# EAGLE design nrf_can (EAGLE 6.4)
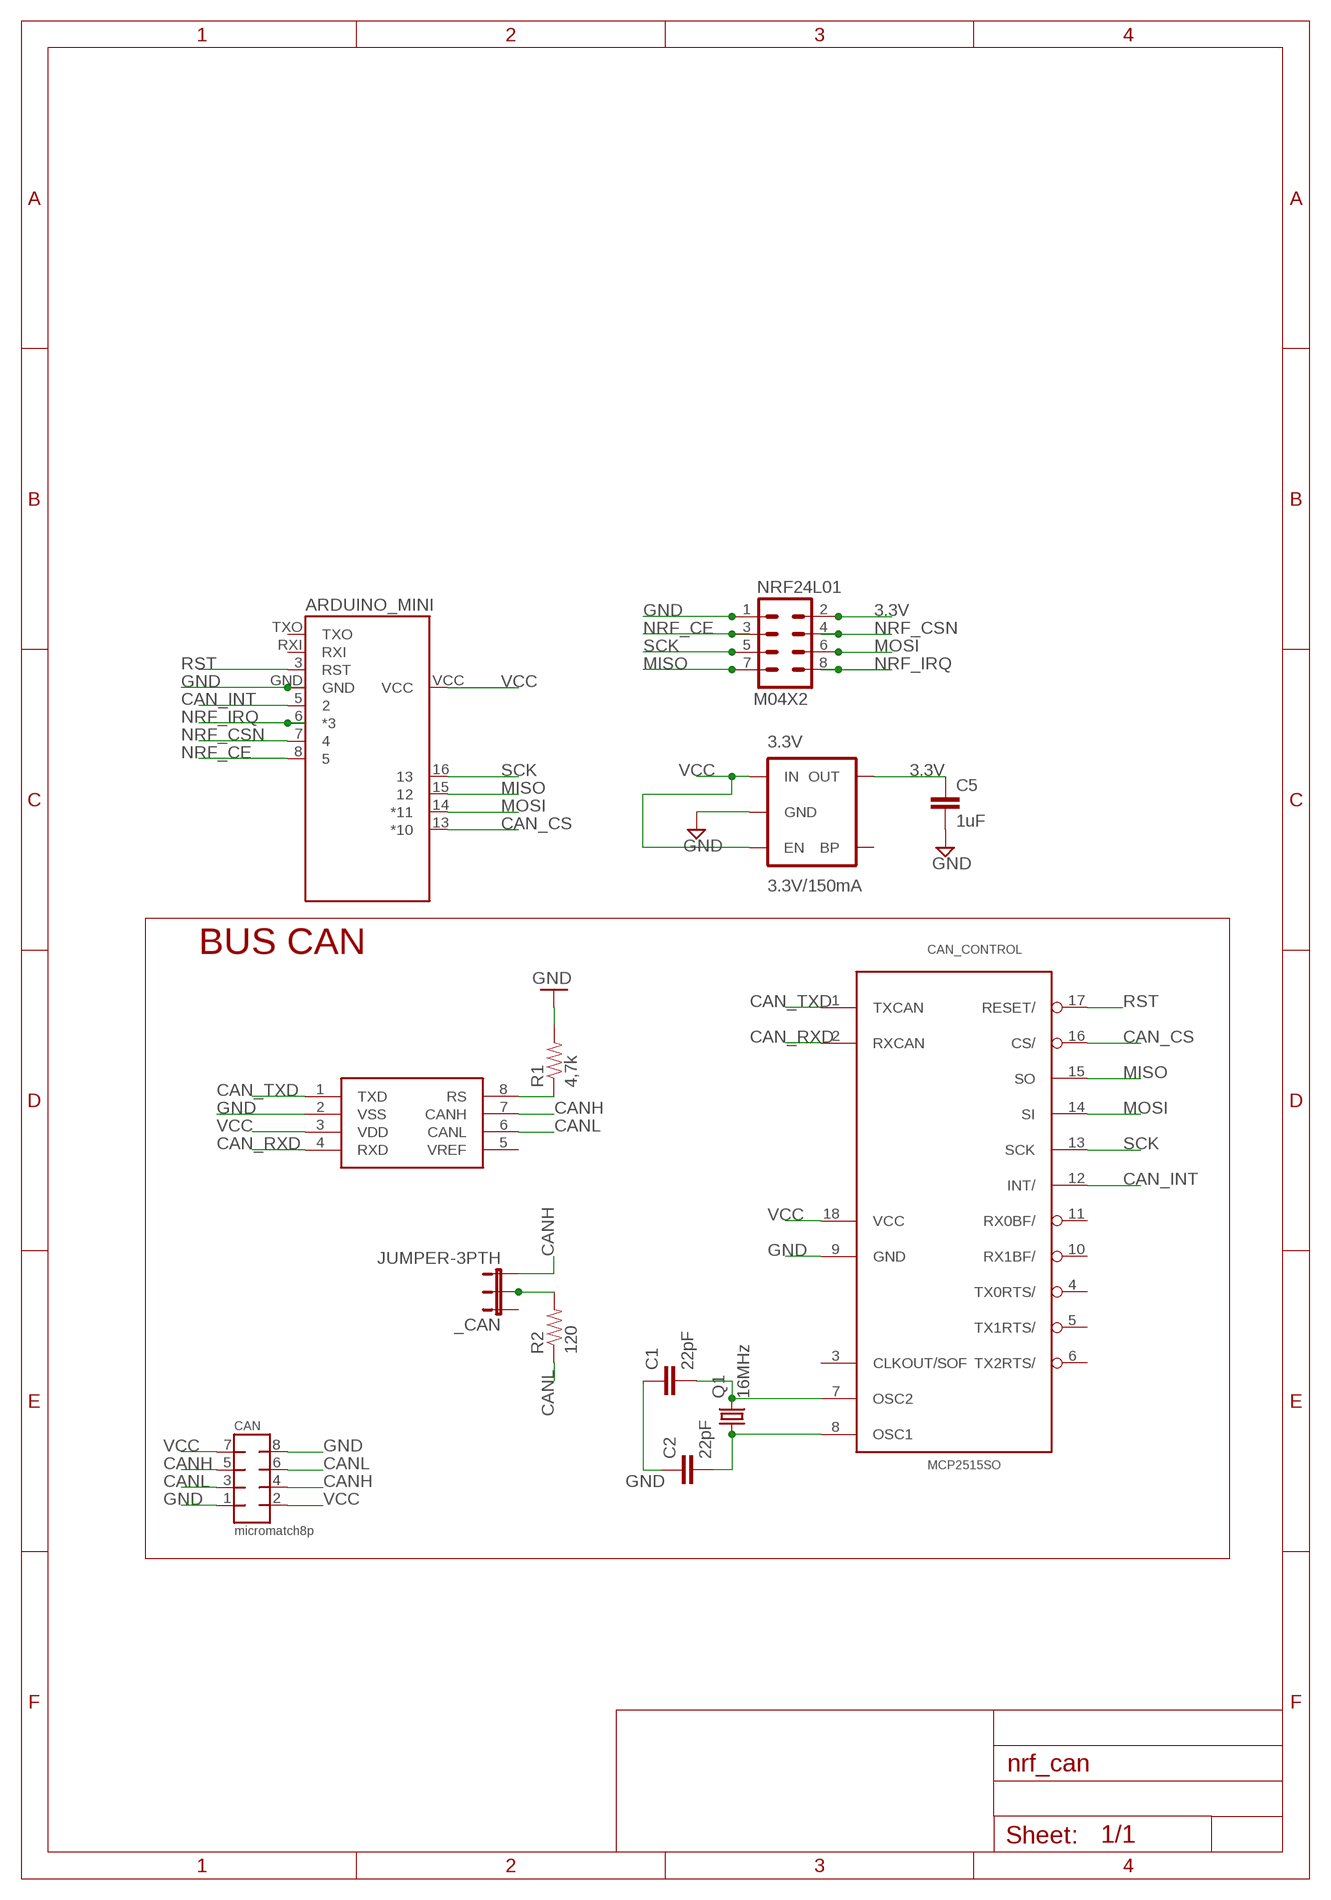
[diagram p0: schematic, sheet 1]

## Parts
3.3V  3.3V/150mA  V_REG_MIC52053.3V  [SOT23-5]
_CAN  JUMPER-3PTH  [1X03]
ARDUINO_MINI  ARDUINO_PRO_MININRF24L01  [ARDUINO_PRO_MINI]
C1  22pF  CAP0805  [0805]
C2  22pF  CAP0805  [0805]
C5  1uF  CAP0805  [0805]
CAN  micromatch8p  MMATCH-8-PTH  [AMP-215079-8]
CAN_CONTROL  MCP2515SO  [SO18L]
NRF24L01  M04X2  [2X4]
Q1  16MHz  CRYSTALHC49S  [HC49/S]
R1  4,7k  RESISTOR0805-RES  [0805]
R2  120  RESISTOR0805-RES  [0805]
TRANSCEIVER  MCP2551  [SO08]

## Nets
3.3V: 3.3V.5(OUT) C5.1 NRF24L01.2
CAN_CS: ARDUINO_MINI.13(*10) CAN_CONTROL.16(CS/)
CAN_INT: ARDUINO_MINI.5 CAN_CONTROL.12(INT/)
CAN_RXD: CAN_CONTROL.2(RXCAN) TRANSCEIVER.4(RXD)
CAN_TXD: CAN_CONTROL.1(TXCAN) TRANSCEIVER.1(TXD)
CANH: _CAN.3 CAN.4 CAN.5 TRANSCEIVER.7(CANH)
CANL: CAN.3 CAN.6 R2.1 TRANSCEIVER.6(CANL)
GND: 3.3V.2(GND) ARDUINO_MINI.GND C1.1 C2.1 C5.2 CAN.1 CAN.8 CAN_CONTROL.9(GND) NRF24L01.1 R1.2 TRANSCEIVER.2(VSS)
MISO: ARDUINO_MINI.15 CAN_CONTROL.15(SO) NRF24L01.7
MOSI: ARDUINO_MINI.14(*11) CAN_CONTROL.14(SI) NRF24L01.6
N$2: C1.2 CAN_CONTROL.7(OSC2) Q1.2
N$3: C2.2 CAN_CONTROL.8(OSC1) Q1.1
N$5: R1.1 TRANSCEIVER.8(RS)
N$7: _CAN.2 R2.2
NRF_CE: ARDUINO_MINI.8 NRF24L01.3
NRF_CSN: ARDUINO_MINI.7 NRF24L01.4
NRF_IRQ: ARDUINO_MINI.6(*3) NRF24L01.8
RST: ARDUINO_MINI.3(RST) CAN_CONTROL.17(RESET/)
SCK: ARDUINO_MINI.16 CAN_CONTROL.13(SCK) NRF24L01.5
VCC: 3.3V.1(IN) 3.3V.3(EN) ARDUINO_MINI.VCC CAN.2 CAN.7 CAN_CONTROL.18(VCC) TRANSCEIVER.3(VDD)
Unconnected: 3.3V.4(BP) _CAN.1 ARDUINO_MINI.RXI ARDUINO_MINI.TXO CAN_CONTROL.3(CLKOUT/SOF) CAN_CONTROL.4(TX0RTS/) CAN_CONTROL.5(TX1RTS/) CAN_CONTROL.6(TX2RTS/) CAN_CONTROL.10(RX1BF/) CAN_CONTROL.11(RX0BF/) TRANSCEIVER.5(VREF)

## Notes on the sheet
- BUS CAN

## Library data of the parts
3.3V = SparkFun-PowerIC:V_REG_MIC5205: V_REG MIC5219 Standard 3.3V and 5V 150mA LDO voltage regulator in SOT-23 layout. Micrel part MIC5205. BP (by-pass) pin is used to lower output noise with 470pF cap, may be left open.; PROD_ID: VREG-00822
_CAN = SparkFun-Passives:JUMPER-3
ARDUINO_MINI = nrf_can:ARDUINO_PRO_MINI
C1 C2 C5 = SparkFun-Capacitors:CAP: Capacitor Standard 0603 ceramic capacitor, and 0.1" leaded capacitor.
CAN = jt-con-micromatch:MMATCH-8-*: AMP Micromatch 8-pin
CAN_CONTROL = MCP2515_MT:MCP2515*: MCP2515 Standalone CAN-Controller by Microchip Eagle-Lib. by MartinThomas
NRF24L01 = SparkFun-Connectors:M04X2: .1" header, two rows of four.
Q1 = adafruit:CRYSTAL: CRYSTAL; OC_FARNELL: 1667008; OC_NEWARK: unknown
R1 R2 = SparkFun-Passives:RESISTOR: Resistor Basic schematic elements and footprints for 0603, 1206, and PTH resistors.
TRANSCEIVER = SparkFun-DigitalIC:MCP2551: CAN transceiver

## Net classes
0 default: clearance 0.205 mm

## Board
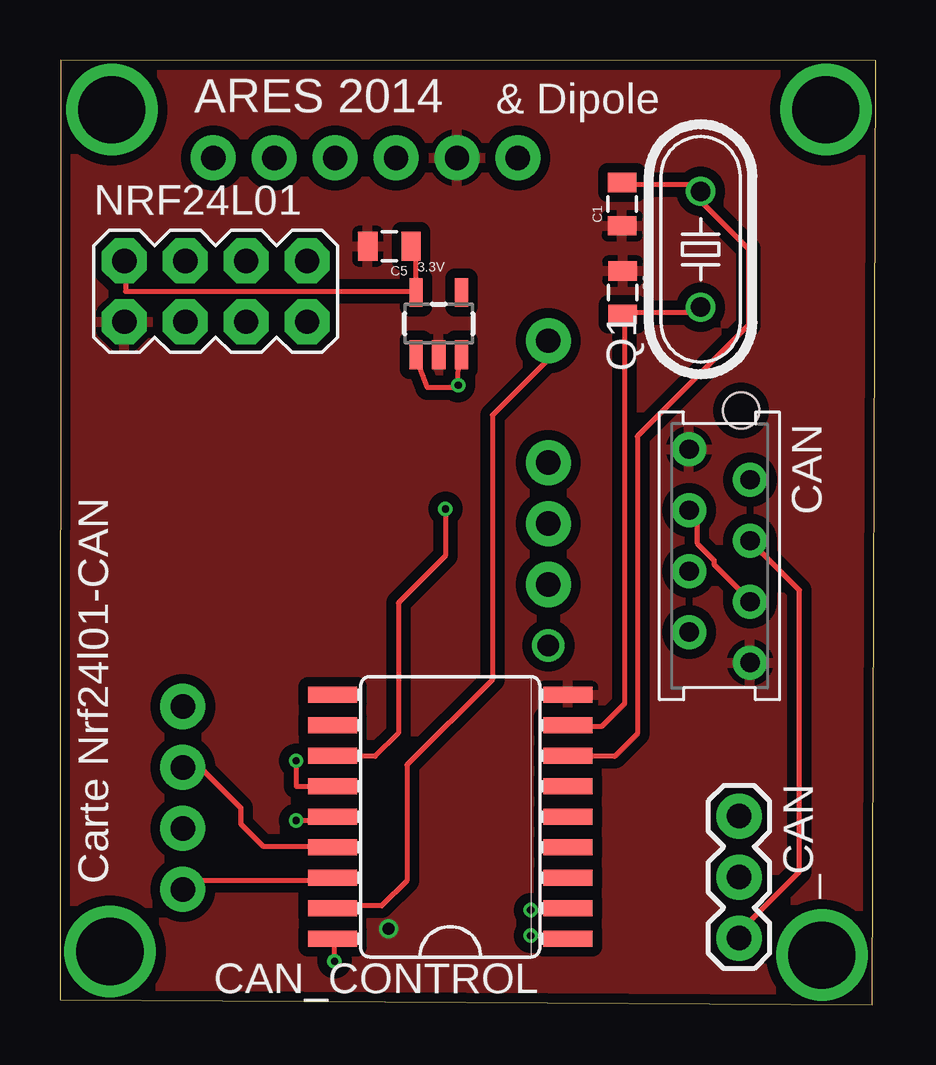
[diagram p1: board, top side]
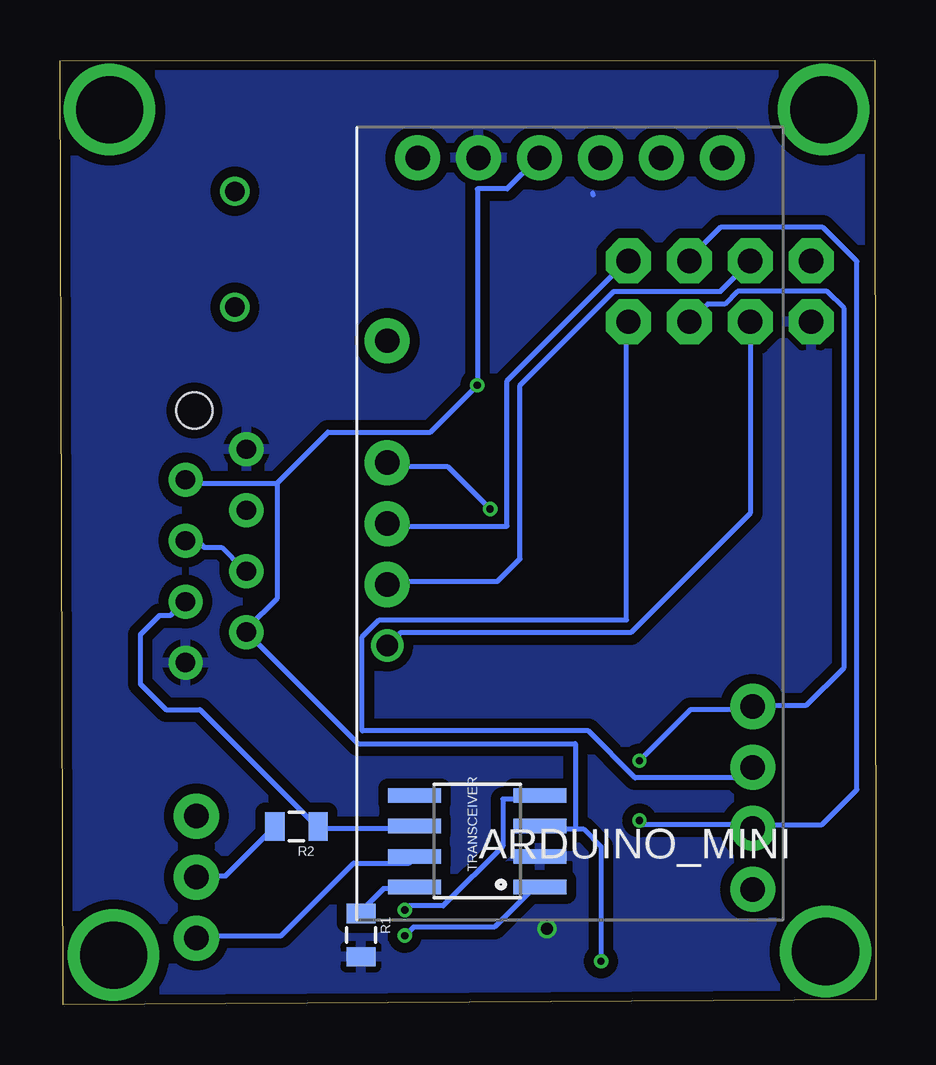
[diagram p2: board, bottom side, seen from below]

Size 34 x 39.36 mm. Coordinates in mm from the lower left corner, seen from the top.
Outline: 0,0.21 33.87,0 34,39.33 0.04,39.36 0,0.21
Copper layers (1*16): Top 0.035mm / dielectric 1.6mm / Bottom 0.035mm
Design rules "dipole *": minimum track width 0.2mm, minimum drill 0.3mm, track to track 0.15mm, track to pad 0.15mm, pad to pad 0.15mm, via to via 0.15mm, smd to smd 0.01mm, copper to edge 0.01mm, drill to drill 0.01mm, minimum pad ring 0.2mm, minimum via ring 0.15mm, stop-mask expansion 1mil, vias tented up to drill 0mil, thermal gap 10mil

### Footprints (pad centres in the part's own frame; a part is rotated, then mirrored left to right if it is on the bottom)
SOT23-5 = smd 0.55 x 1.2: 1 -0.95,-1.3; 2 0,-1.3; 3 0.95,-1.3; 4 0.95,1.3; 5 -0.95,1.3
1X03 = drill 1.016 pad 1.88: 1 0,0; 2 2.54,0; 3 5.08,0
ARDUINO_PRO_MINI = drill 1.016 pad 1.88: 3 -7.62,7.62; 5 -7.62,2.54; 6 -7.62,0; 7 -7.62,-2.54; 13 7.62,-15.24; 14 7.62,-12.7; 15 7.62,-10.16; 16 7.62,-7.62; BLK -6.35,15.24; GND -3.81,15.24; GRN 6.35,15.24; RXI 1.27,15.24; TXO 3.81,15.24; VCC -1.27,15.24 | drill 0.9: 8 -7.62,-5.08
0805 = smd 0.8 x 1.2: 1 -0.9,0; 2 0.9,0
AMP-215079-8 = drill 0.8 pad 1.422: 1 0,-1.27; 2 1.27,1.27; 3 2.54,-1.27; 4 3.81,1.27; 5 5.08,-1.27; 6 6.35,1.27; 7 7.62,-1.27; 8 8.89,1.27 | hole 1.5: -1.62,0.905
SO18L = smd 0.66 x 2.032: 1 -5.08,-4.902; 2 -3.81,-4.902; 3 -2.54,-4.902; 4 -1.27,-4.902; 5 0,-4.902; 6 1.27,-4.902; 7 2.54,-4.902; 8 3.81,-4.902; 9 5.08,-4.902; 10 5.08,4.902; 11 3.81,4.902; 12 2.54,4.902; 13 1.27,4.902; 14 0,4.902; 15 -1.27,4.902; 16 -2.54,4.902; 17 -3.81,4.902; 18 -5.08,4.902
2X4 = drill 1.016 pad 1.88 octagon: 1 -3.81,-1.27; 2 -3.81,1.27; 3 -1.27,-1.27; 4 -1.27,1.27; 5 1.27,-1.27; 6 1.27,1.27; 7 3.81,-1.27; 8 3.81,1.27
HC49/S = drill 0.813: 1 -2.413,0; 2 2.413,0
SO08 = smd 0.61 x 2.21: 1 -1.905,-2.616; 2 -0.635,-2.616; 3 0.635,-2.616; 4 1.905,-2.616; 5 1.905,2.616; 6 0.635,2.616; 7 -0.635,2.616; 8 -1.905,2.616

### Placement (x,y rotation side)
3.3V  15.79,28.37 0 top
_CAN  28.31,7.85 270 top
ARDUINO_MINI  12.74,20.04 0 bottom
C1  23.43,33.35 90 top
C2  23.46,29.67 270 top
C5  13.73,31.6 180 top
CAN  27.5,23.14 270 top
CAN_CONTROL  16.27,7.82 90 top
NRF24L01  6.49,29.72 0 top
Q1  26.71,31.47 90 top
R1  21.45,2.9 270 bottom
R2  24.14,7.42 180 bottom
TRANSCEIVER  16.6,6.81 90 bottom

### Tracks (layer width: path | path; a pad name or v marks a point on that pad's centre or on a via)
3.3V
  Top 0.2: 14.82,29.72 14.82,31.32 14.65,31.5 C5.1 | 14.82,29.72 2.73,29.72 2.73,30.96 NRF24L01.2 | 14.82,29.72 3.3V.5
CAN_CS
  Top 0.2: CAN_CONTROL.16 11.27,5.18 5.22,5.18 5.22,4.83 ARDUINO_MINI.13
CAN_INT  (via drill 0.3)
  Top 0.2: v16.07,20.65 16.07,18.69 14.11,16.74 14.11,11.31 13.14,10.34 11.45,10.34 CAN_CONTROL.12
  Bottom 0.2: v16.07,20.65 17.85,22.43 20.34,22.43 ARDUINO_MINI.5
CAN_RXD  (via drill 0.3)
  Top 0.2: v19.62,3.94 21.05,3.94 CAN_CONTROL.2
  Bottom 0.2: v19.62,3.94 19.45,4.11 18.02,4.11 15.53,6.6 15.53,8.56 14.11,8.56 TRANSCEIVER.4
CAN_TXD  (via drill 0.3)
  Top 0.2: v19.62,2.87 21.05,2.87 CAN_CONTROL.1
  Bottom 0.2: v19.62,2.87 19.27,3.23 15.89,3.23 14.29,4.83 14.11,4.83 TRANSCEIVER.1
CANH
  Top 0.2: CAN.4 30.83,17.27 30.83,5.54 28.34,3.05 28.34,2.87 _CAN.3
  Bottom 0.2: CAN.5 26.38,18.16 27.27,19.05 27.98,19.05 28.16,19.23 28.69,19.23 CAN.4 | TRANSCEIVER.7 19.27,6.07 19.45,5.89 21.76,5.89 24.78,2.87 28.16,2.87 _CAN.3
CANL
  Top 0.2: CAN.6 28.69,16.92 27.27,18.34 27.27,18.52 26.56,19.23 26.56,20.29 26.38,20.47 CAN.3
  Bottom 0.2: TRANSCEIVER.6 19.27,7.32 23.18,7.32 R2.1 23.36,7.49 28.16,12.29 29.58,12.29 30.65,13.36 30.65,15.41 29.85,16.21 29.4,16.21 28.87,16.74 CAN.6
GND  (via drill 0.5)
  Bottom 0.2: 11.8,33.81 11.78,33.73
  other vias: 13.69,3.16
  pour Bottom (isolate 0.406): -5.04,39.09 -5.04,-2.82 34.33,-2.82 34.33,40.36 -5.04,40.36
  pour Top (isolate 0.406): -4.48,40.26 -5.04,-2.82 34.33,-2.82 34.33,40.36
MISO
  Top 0.2: CAN_CONTROL.15 11.27,6.6 8.46,6.6 7.53,7.53 7.53,8.2 5.93,9.8 5.22,9.8 ARDUINO_MINI.15
  Bottom 0.2: NRF24L01.7 10.38,28.3 10.38,16.03 20.69,16.03 21.4,15.32 21.4,11.4 11.98,11.4 10.02,9.45 5.58,9.45 5.22,9.8 ARDUINO_MINI.15
MOSI  (via drill 0.3)
  Top 0.2: v9.84,7.67 11.27,7.67 CAN_CONTROL.14
  Bottom 0.2: NRF24L01.6 7.71,31.14 6.47,32.38 2.2,32.38 0.78,30.96 0.78,8.95 2.24,7.49 5.04,7.49 ARDUINO_MINI.14 5.22,7.49 9.67,7.49 v9.84,7.67
N$1  (via drill 2.8)
  other vias: 2.08,2.21
N$2
  Top 0.2: C1.2 23.54,34.16 26.56,34.16 26.56,33.99 Q1.2 26.74,33.81 26.74,33.45 28.69,31.5 28.69,28.3 24.07,23.67 24.07,11.28 23.13,10.34 21.22,10.34 CAN_CONTROL.7
N$3
  Top 0.2: Q1.1 26.56,29.01 26.56,28.83 23.54,28.83 C2.2 23.54,28.65 23.54,12.53 22.58,11.58 21.22,11.58 CAN_CONTROL.8
N$4  (via drill 2.8)
  other vias: 31.76,2.06
N$5
  Bottom 0.2: R1.1 21.4,3.94 20.51,4.83 19.27,4.83 TRANSCEIVER.8
N$6  (via drill 2.8)
  other vias: 31.93,37.29
N$7
  Top 0.2: 28.34,5.36 _CAN.2
  Bottom 0.2: R2.2 25.14,7.32 27.09,5.36 28.16,5.36 _CAN.2
N$8  (via drill 2.8)
  other vias: 2.16,37.29
NRF_CE
  Bottom 0.2: NRF24L01.3 5.22,20.47 10.2,15.49 19.8,15.49 20.34,14.96 ARDUINO_MINI.8
NRF_CSN
  Bottom 0.2: NRF24L01.4 5.22,30.96 6.47,29.72 10.91,29.72 14.82,25.81 14.82,18.57 15.77,17.63 20.34,17.63 ARDUINO_MINI.7
NRF_IRQ
  Bottom 0.2: NRF24L01.8 10.38,30.96 15.36,25.98 15.36,19.94 20.34,19.94 ARDUINO_MINI.6
RST
  Top 0.2: CAN_CONTROL.17 11.45,4.11 13.42,4.11 14.47,5.17 14.47,9.98 18.02,13.54 18.02,24.56 20.34,26.87 20.34,27.58 ARDUINO_MINI.3
SCK  (via drill 0.3)
  Top 0.2: CAN_CONTROL.13 9.84,9.09 v9.84,10.16
  Bottom 0.2: v9.84,10.16 7.71,12.29 5.22,12.29 ARDUINO_MINI.16 5.04,12.47 2.88,12.47 1.31,14.04 1.31,29.01 2.02,29.72 5.76,29.72 6.29,29.18 7,29.18 7.71,28.47 NRF24L01.5
VCC  (via drill 0.3)
  Top 0.2: 16.56,25.71 15.32,25.71 15,26.52 15,27.05 3.3V.1 | 16.56,25.71 16.6,27.05 3.3V.3 | v16.6,25.81 16.56,25.71 | v11.45,1.8 11.45,2.69 CAN_CONTROL.18
  Bottom 0.2: ARDUINO_MINI.VCC 14.11,35.23 15.36,33.99 16.6,33.99 v16.6,25.81 18.56,23.85 22.82,23.85 24.96,21.72 | 12.51,7.32 12.18,7.32 11.45,6.58 v11.45,1.8 | 12.51,7.32 13.93,7.32 TRANSCEIVER.3 | 24.96,21.72 24.96,16.92 26.2,15.67 CAN.7 21.58,10.87 12.51,10.87 12.51,7.32 | 24.96,21.72 28.69,21.72 CAN.2

### Text on the board
tNames: ARES 2014 | & Dipole | RF-CAN ARES 2014 | RF-CAN ARES 2014 | Carte Nrf24l01-CAN | RF-CAN ARES 2014 | RF-CAN ARES 2014
200bmp: aaa | /home/showok/.eagle/logo_ares_3.bmp | /home/showok/Documents/Projets/Ares/Robot-2013-2014/cartes/logo_ares_3.bmp
201bmp: /home/showok/.eagle/logo_ares_3.bmp